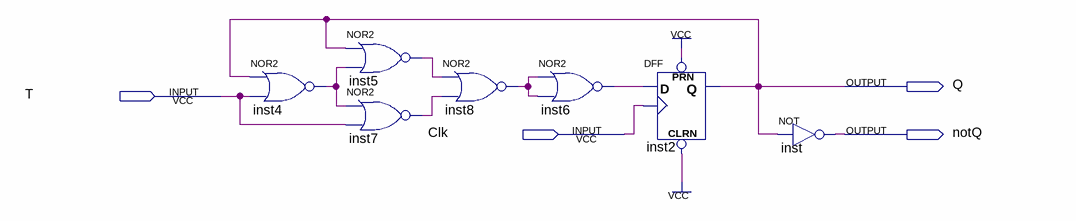
[diagram p0: schematic sheet]
// Quartus schematic T_FLIPFLOP.bdf as structural Verilog: 7 symbols, 4 pins
module T_FLIPFLOP (
  input  T,
  input  Clk,
  output Q,
  output notQ
);

  wire inst4_out, inst5_out, inst6_out, inst7_out, inst8_out;

  nor inst4 (inst4_out, Q, T);
  nor inst5 (inst5_out, Q, inst4_out);
  nor inst7 (inst7_out, inst4_out, T);
  nor inst8 (inst8_out, inst5_out, inst7_out);
  nor inst6 (inst6_out, inst8_out, inst8_out);
  DFF inst2 (.CLRN(1'b1), .CLK(Clk), .D(inst6_out), .PRN(1'b1), .Q(Q));
  not inst (notQ, Q);
endmodule
